# Altium schematic sheet CAN.SchDoc
size A4; SheetNumber: 4; SheetTotal: 9
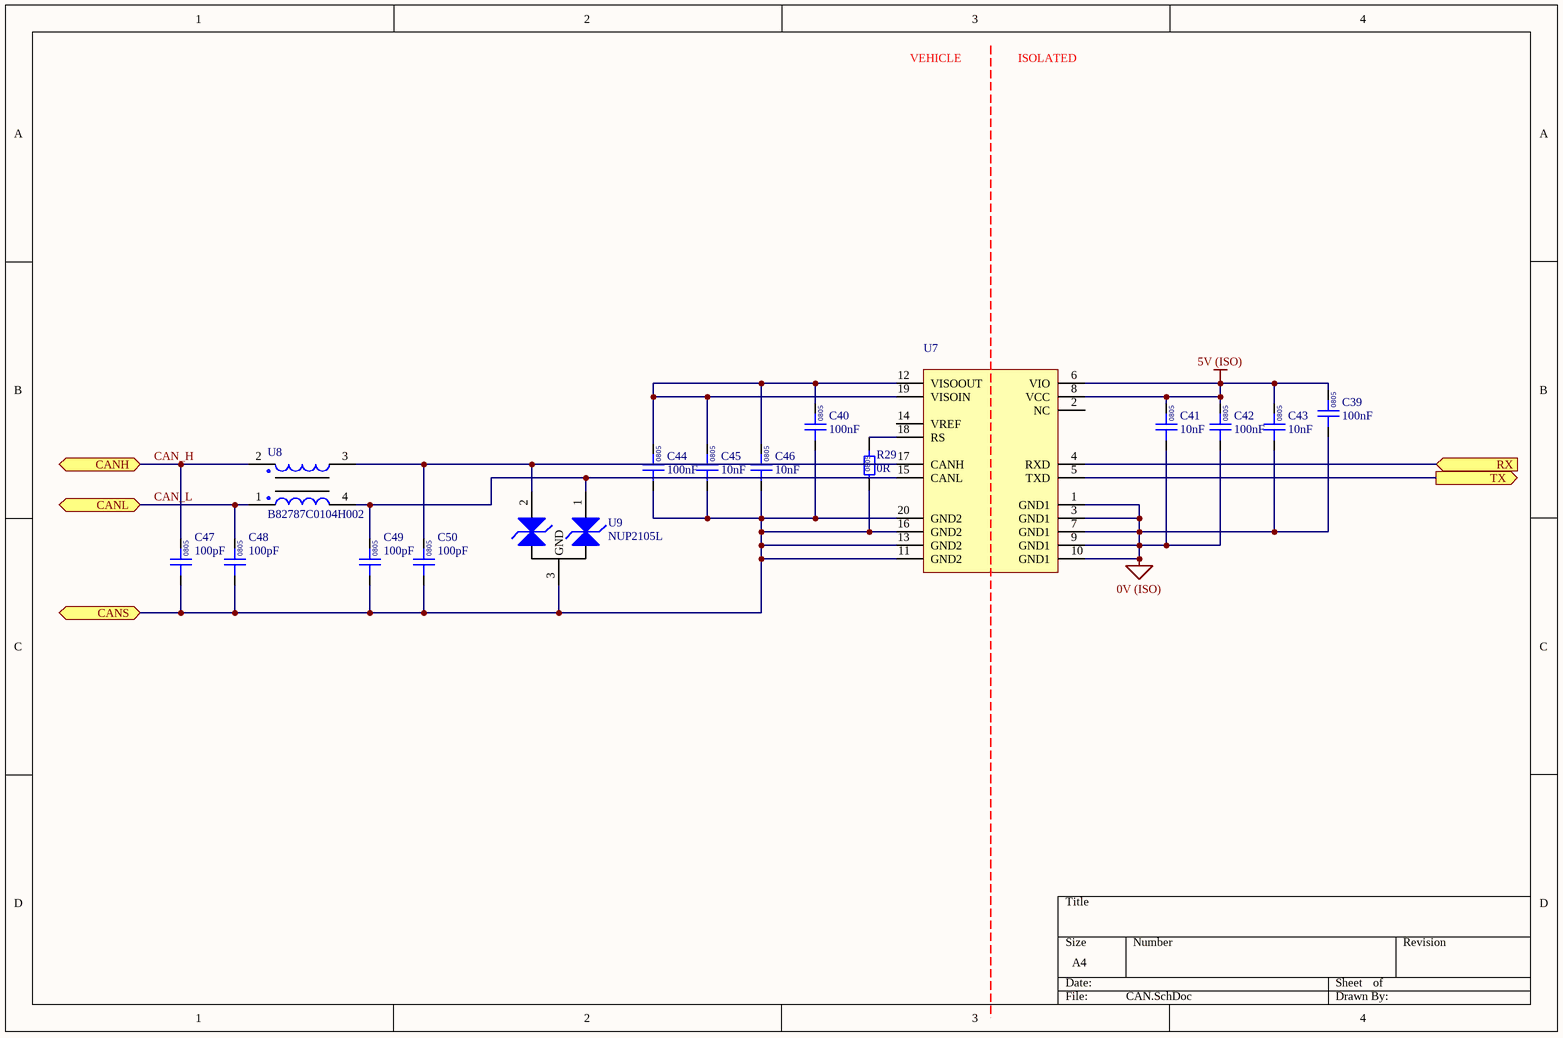
[diagram p0: CAN.SchDoc]

## Parts
C39  100nF  [0805]
C40  100nF  [0805]
C41  10nF  [0805]
C42  100nF  [0805]
C43  10nF  [0805]
C44  100nF  [0805]
C45  10nF  [0805]
C46  10nF  [0805]
C47  100pF  [0805]
C48  100pF  [0805]
C49  100pF  [0805]
C50  100pF  [0805]
R29  0R  [0805]
U7  (no value)  [AD SOIC-W 20]
U8  B82787C0104H002  [TDK 4-PC Pad]
U9  NUP2105L  [ON SOT-23]

## Ports
CANH (bidir), CANL (bidir), CANS (bidir), RX (in), TX (out)

## Nets
0V (ISO): C39.1 C41.1 C42.1 C43.1 U7.1(GND1) U7.3(GND1) U7.7(GND1) U7.9(GND1) U7.10(GND1)
5V (ISO): C39.2 C41.2 C42.2 C43.2 U7.6(VIO) U7.8(VCC)
CAN_H: C47.2 U8.2 ; port CANH
CAN_L: C48.2 U8.1 ; port CANL
CANS: C40.1 C44.1 C45.1 C46.1 C47.1 C48.1 C49.1 C50.1 R29.1 U7.11(GND2) U7.13(GND2) U7.16(GND2) U7.20(GND2) U9.3(GND) ; port CANS
RX: U7.4(RXD) ; port RX
TX: U7.5(TXD) ; port TX
NetC40_2: C40.2 C44.2 C45.2 C46.2 U7.12(VISOOUT) U7.19(VISOIN)
NetC49_2: C49.2 U7.15(CANL) U8.4 U9.1(CAN_H)
NetC50_2: C50.2 U7.17(CANH) U8.3 U9.2(CAN_L)
NetR29_2: R29.2 U7.18(RS)

Not connected (* = marked no-connect by the designer): U7 2(NC) 14(VREF)

## Notes on the sheet
- VEHICLE
- ISOLATED
- (in symbol GCM21BR71H104KA37L) 0805
- (in symbol GCM2165C1H101JA16D) 0805
- (in symbol GCM2195C1H103JA16D) 0805
- (in symbol RC0805FR070RL) 0805

## Library data of the parts
C39 C40 C42 C44 = GCM21BR71H104KA37L: Manufacturer: muRata; Tolerance: ±10%; Material: MLCC; Rated Voltage: 50V; Temperature Rating: X7R; Part Number: GCM21BR71H104KA37L; Value: 100nF; Digikey Part Number: 490-6064-1-ND
C41 C43 C45 C46 = GCM2195C1H103JA16D: Manufacturer: muRata; Tolerance: ±5%; Material: MLCC; Rated Voltage: 50V; Temperature Rating: C0G, NP0; Part Number: GCM2195C1H103JA16D; Value: 10nF; Digikey Part Number: 490-4783-1-ND
C47-C50 = GCM2165C1H101JA16D: Manufacturer: muRata; Tolerance: ±5%; Material: MLCC; Rated Voltage: 50V; Temperature Rating: C0G, NP0; Part Number: GCM2165C1H101JA16D; Value: 100pF; Digikey Part Number: 490-8031-1-ND
R29 = RC0805FR070RL: Manufacturer: YAGEO; Tolerance: 0.01; Rated Power: 0.125W; Part Number: RC0805FR070RL; Value: 0R; Material: FR-07; Digikey Part Number: 311-0.0CRCT-ND
U7 = ADM3053: Isolated CAN Transceiver; Manufacturer: Analogue Devices; Part Number: ADM3053; Digikey Part Number: ADM3053BRWZ-ND; Digikey Link: https://www.digikey.com/product-detail/en/analog-devices-inc/ADM3053BRWZ/ADM3053BRWZ-ND/2709332
U8 = B82787C0104H002: Manufacturer: EPCOS (TDK); Value: 100µH @ 100kHz; Impedance: 5.8 kOhms @ 10MHz; Rated Current: 150mA; Part Number: B82787C0104H002; Material: Wirewound; Digikey Part Number: 495-4598-1-ND
U9 = NUP2105L: Dual Line CAN Bus Protector; Manufacturer: ON Semiconductor; Part Number: NUP2105L; Digikey Part Number: NUP2105LT1GOSCT-ND; Digikey Link: https://www.digikey.com/product-detail/en/on-semiconductor/NUP2105LT1G/NUP2105LT1GOSCT-ND/1485001